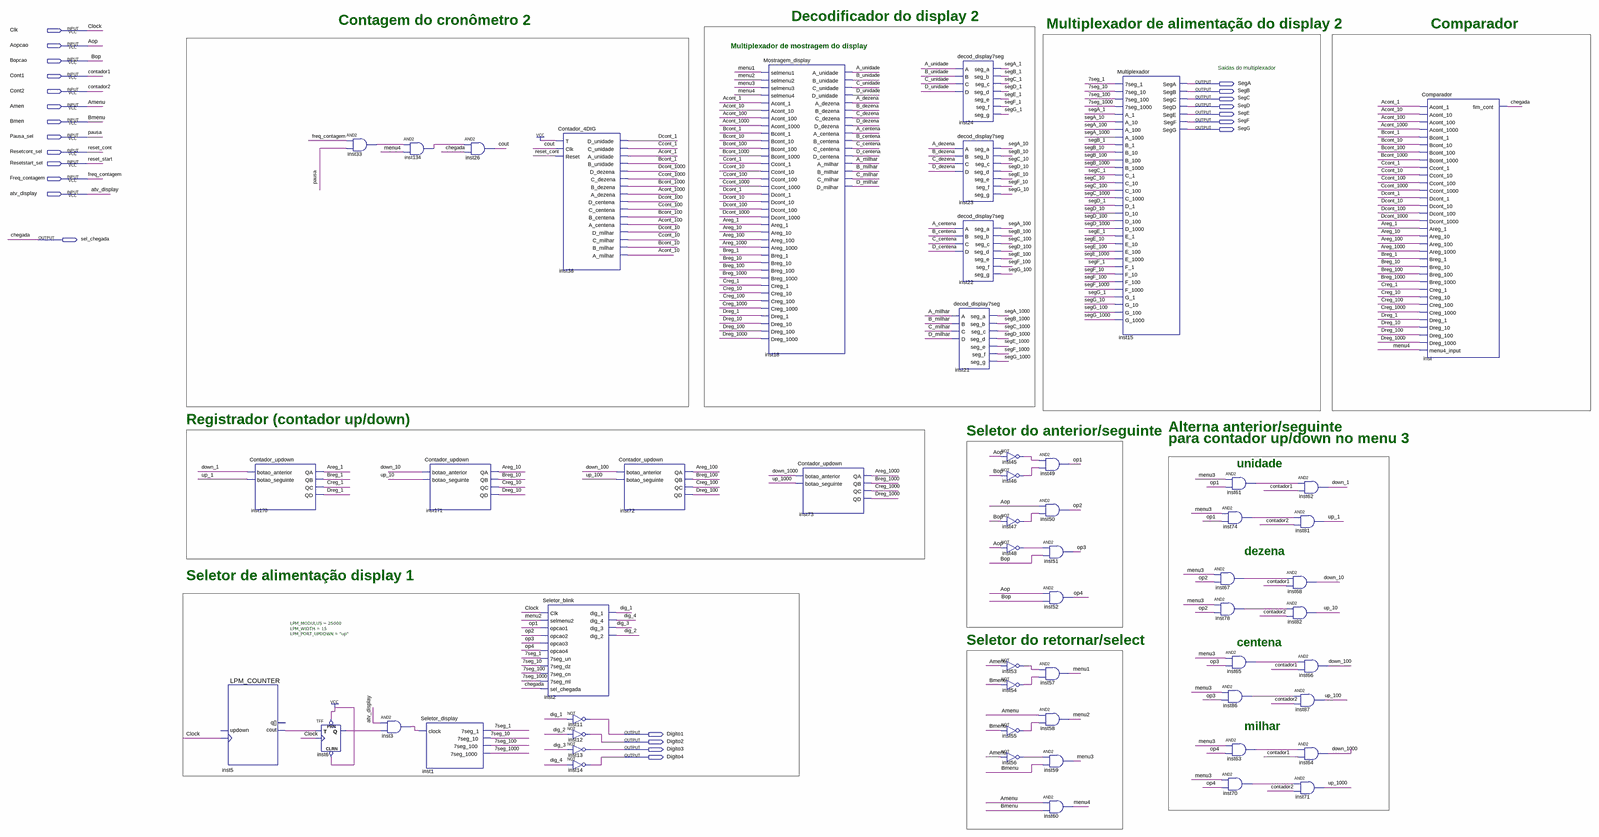
[diagram p0: schematic sheet, whole]
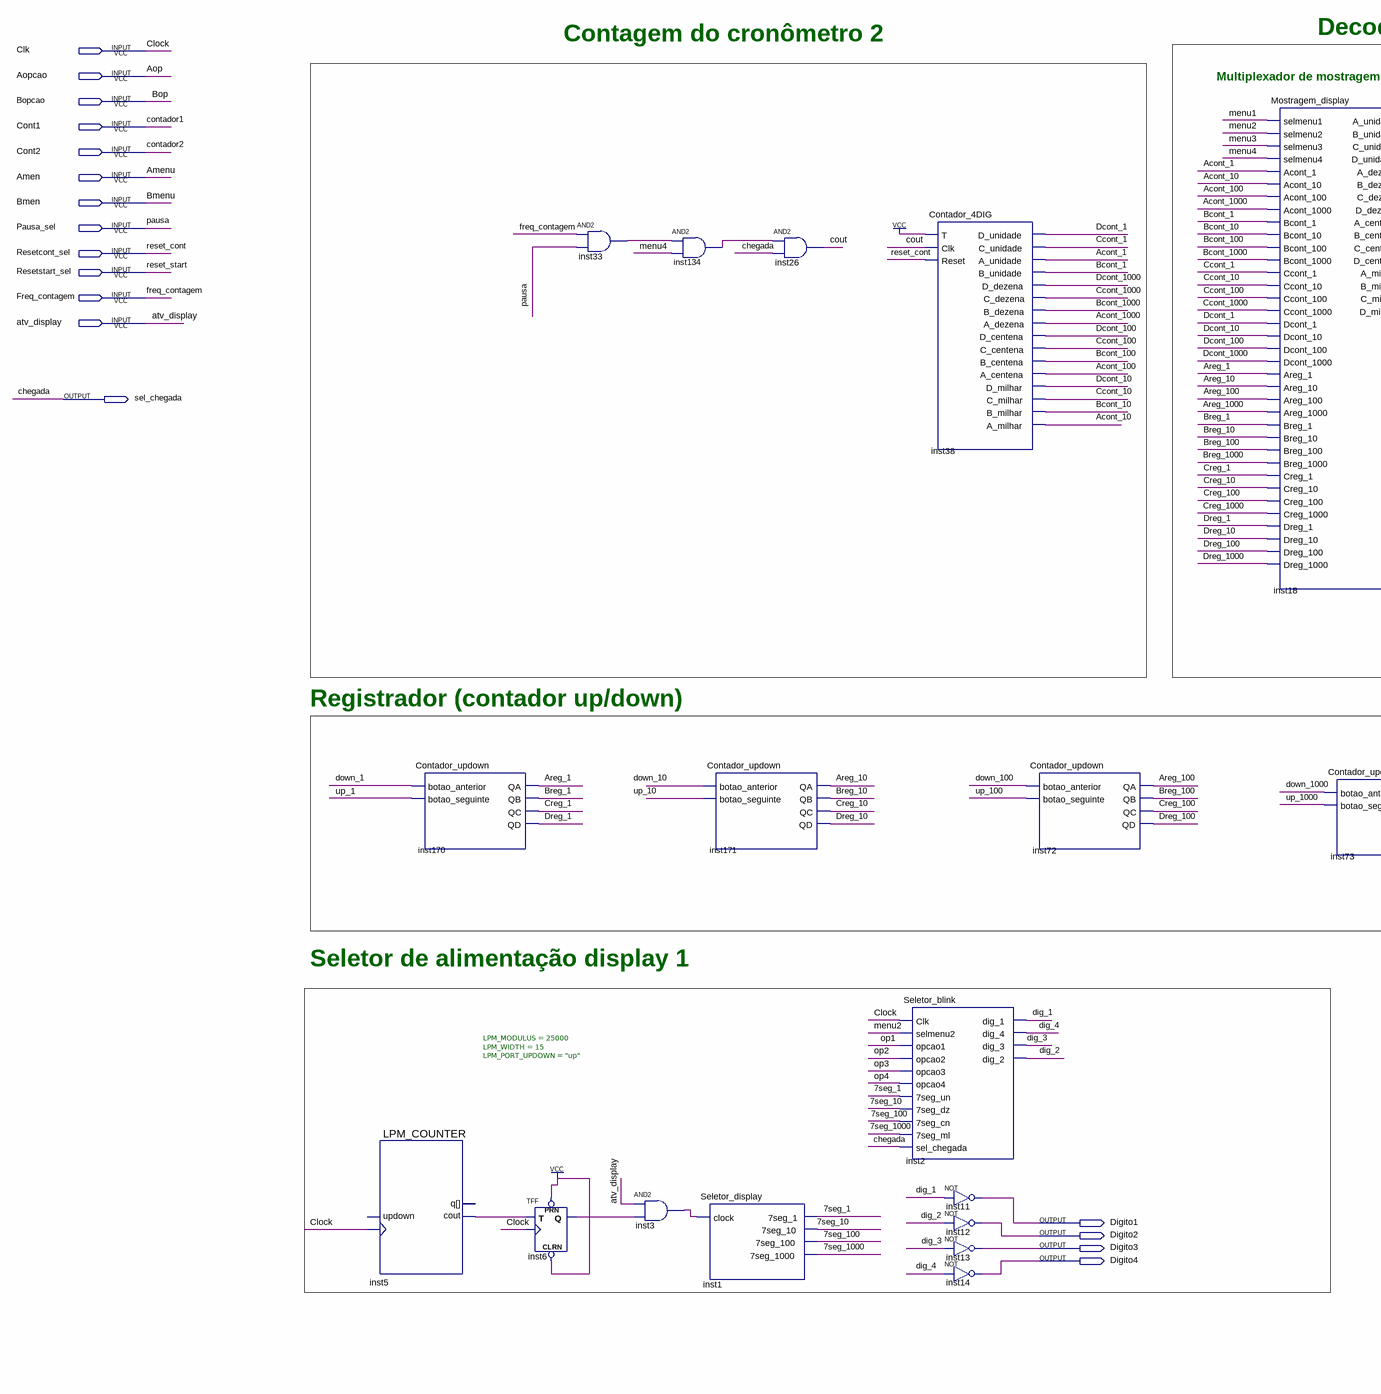
[diagram p1: schematic sheet, left part]
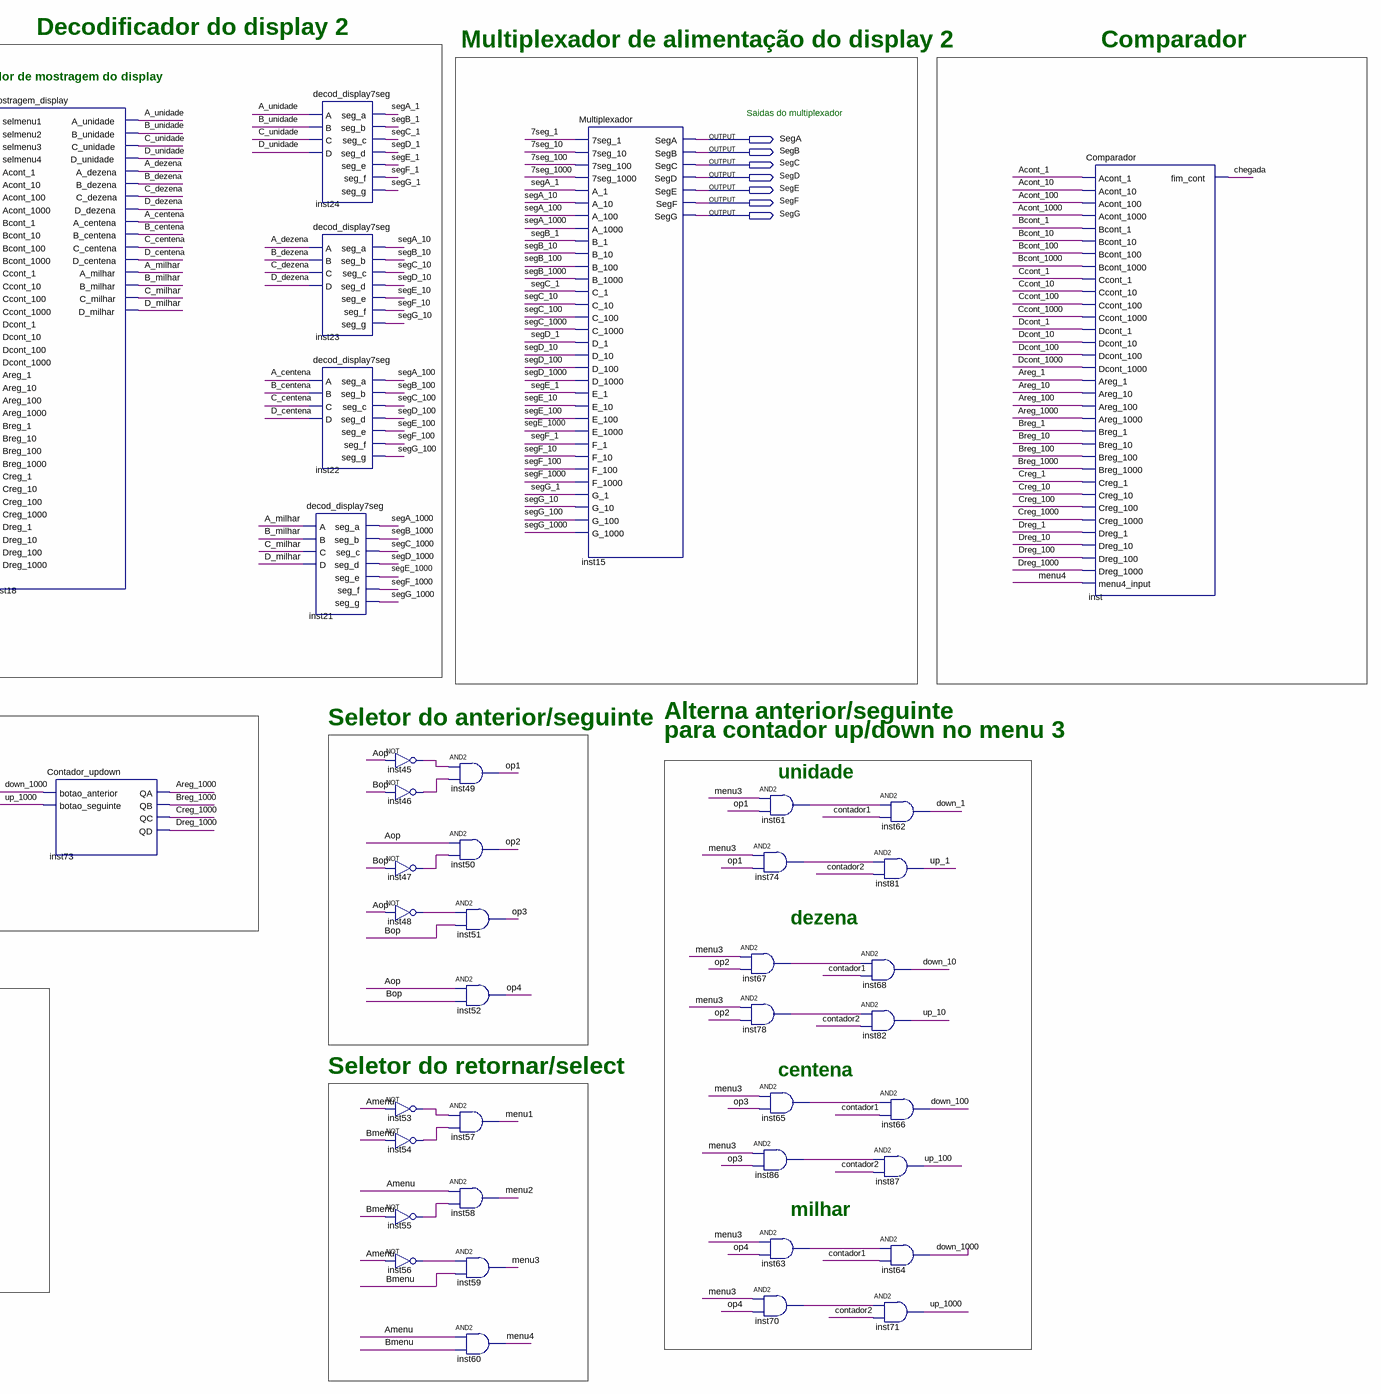
[diagram p2: schematic sheet, right part]
// Quartus schematic Cronometro_2.bdf as structural Verilog: 56 symbols, 24 pins
module Cronometro_2 (
  input  Clk,
  input  Aopcao,
  input  Bopcao,
  input  Cont1,
  input  Cont2,
  input  Amen,
  input  Bmen,
  input  Pausa_sel,
  input  Resetcont_sel,
  input  Resetstart_sel,
  input  Freq_contagem,
  input  atv_display,
  output SegA,
  output SegB,
  output SegC,
  output SegD,
  output SegE,
  output SegF,
  output SegG,
  output sel_chegada,
  output Digito1,
  output Digito2,
  output Digito3,
  output Digito4
);

  wire \7seg_1 , \7seg_10 , \7seg_100 , \7seg_1000 , A_centena, A_dezena, A_milhar, A_unidade, Acont_1,
       Acont_10, Acont_100, Acont_1000, Areg_1, Areg_10, Areg_100, Areg_1000, B_centena, B_dezena, B_milhar,
       B_unidade, Bcont_1, Bcont_10, Bcont_100, Bcont_1000, Breg_1, Breg_10, Breg_100, Breg_1000, C_centena,
       C_dezena, C_milhar, C_unidade, Ccont_1, Ccont_10, Ccont_100, Ccont_1000, cout, Creg_1, Creg_10,
       Creg_100, Creg_1000, D_centena, D_dezena, D_milhar, D_unidade, Dcont_1, Dcont_10, Dcont_100,
       Dcont_1000, dig_1, dig_2, dig_3, dig_4, down_1, down_10, down_100, down_1000, Dreg_1, Dreg_10,
       Dreg_100, Dreg_1000, inst3_out, inst5_cout, inst6_q, inst33_out, inst45_out, inst46_out, inst47_out,
       inst48_out, inst53_out, inst54_out, inst55_out, inst56_out, inst61_out, inst63_out, inst65_out,
       inst67_out, inst70_out, inst74_out, inst78_out, inst86_out, inst134_out, menu1, menu2, menu3, menu4,
       op1, op2, op3, op4, segA_1, segA_10, segA_100, segA_1000, segB_1, segB_10, segB_100, segB_1000,
       segC_1, segC_10, segC_100, segC_1000, segD_1, segD_10, segD_100, segD_1000, segE_1, segE_10, segE_100,
       segE_1000, segF_1, segF_10, segF_100, segF_1000, segG_1, segG_10, segG_100, segG_1000, up_1, up_10,
       up_100, up_1000;

  LPM_COUNTER #(.LPM_MODULUS(25000), .LPM_WIDTH(15), .LPM_PORT_UPDOWN("up")) inst5 (
    .clock(Clk), .cout(inst5_cout));  // open: updown, q
  Contador_updown inst170 (
    .botao_anterior(down_1), .botao_seguinte(up_1), .QA(Areg_1), .QB(Breg_1), .QC(Creg_1), .QD(Dreg_1));
  TFF inst6 (.PRN(1'b1), .CLRN(1'b1), .T(inst5_cout), .CLK(Clk), .Q(inst6_q));
  and inst33 (inst33_out, Freq_contagem, Pausa_sel);
  and inst134 (inst134_out, inst33_out, menu4);
  and inst3 (inst3_out, atv_display, inst6_q);
  Contador_updown inst171 (
    .botao_anterior(down_10), .botao_seguinte(up_10), .QA(Areg_10), .QB(Breg_10), .QC(Creg_10), .QD(Dreg_10));
  Seletor_display inst1 (
    .clock(inst3_out), .\7seg_1 (\7seg_1 ), .\7seg_10 (\7seg_10 ), .\7seg_100 (\7seg_100 ),
    .\7seg_1000 (\7seg_1000 ));
  and inst26 (cout, inst134_out, sel_chegada);
  Contador_4DIG inst38 (
    .T(1'b1), .Clk(cout), .Reset(Resetcont_sel), .D_unidade(Dcont_1), .C_unidade(Ccont_1),
    .A_unidade(Acont_1), .B_unidade(Bcont_1), .D_dezena(Dcont_1000), .C_dezena(Ccont_1000),
    .B_dezena(Bcont_1000), .A_dezena(Acont_1000), .D_centena(Dcont_100), .C_centena(Ccont_100),
    .B_centena(Bcont_100), .A_centena(Acont_100), .D_milhar(Dcont_10), .C_milhar(Ccont_10),
    .B_milhar(Bcont_10), .A_milhar(Acont_10));
  Seletor_blink inst2 (
    .Clk(Clk), .selmenu2(menu2), .opcao1(op1), .opcao2(op2), .opcao3(op3), .opcao4(op4),
    .\7seg_un (\7seg_1 ), .\7seg_dz (\7seg_10 ), .\7seg_cn (\7seg_100 ), .\7seg_ml (\7seg_1000 ),
    .sel_chegada(sel_chegada), .dig_1(dig_1), .dig_4(dig_4), .dig_3(dig_3), .dig_2(dig_2));
  not inst11 (Digito1, dig_1);
  not inst12 (Digito2, dig_2);
  not inst13 (Digito3, dig_3);
  not inst14 (Digito4, dig_4);
  Contador_updown inst72 (
    .botao_anterior(down_100), .botao_seguinte(up_100), .QA(Areg_100), .QB(Breg_100), .QC(Creg_100),
    .QD(Dreg_100));
  Mostragem_display inst18 (
    .selmenu1(menu1), .selmenu2(menu2), .selmenu3(menu3), .selmenu4(menu4), .Acont_1(Acont_1),
    .Acont_10(Acont_10), .Acont_100(Acont_100), .Acont_1000(Acont_1000), .Bcont_1(Bcont_1),
    .Bcont_10(Bcont_10), .Bcont_100(Bcont_100), .Bcont_1000(Bcont_1000), .Ccont_1(Ccont_1),
    .Ccont_10(Ccont_10), .Ccont_100(Ccont_100), .Ccont_1000(Ccont_1000), .Dcont_1(Dcont_1),
    .Dcont_10(Dcont_10), .Dcont_100(Dcont_100), .Dcont_1000(Dcont_1000), .Areg_1(Areg_1), .Areg_10(Areg_10),
    .Areg_100(Areg_100), .Areg_1000(Areg_1000), .Breg_1(Breg_1), .Breg_10(Breg_10), .Breg_100(Breg_100),
    .Breg_1000(Breg_1000), .Creg_1(Creg_1), .Creg_10(Creg_10), .Creg_100(Creg_100), .Creg_1000(Creg_1000),
    .Dreg_1(Dreg_1), .Dreg_10(Dreg_10), .Dreg_100(Dreg_100), .Dreg_1000(Dreg_1000), .A_unidade(A_unidade),
    .B_unidade(B_unidade), .C_unidade(C_unidade), .D_unidade(D_unidade), .A_dezena(A_dezena),
    .B_dezena(B_dezena), .C_dezena(C_dezena), .D_dezena(D_dezena), .A_centena(A_centena),
    .B_centena(B_centena), .C_centena(C_centena), .D_centena(D_centena), .A_milhar(A_milhar),
    .B_milhar(B_milhar), .C_milhar(C_milhar), .D_milhar(D_milhar));
  Contador_updown inst73 (
    .botao_anterior(down_1000), .botao_seguinte(up_1000), .QA(Areg_1000), .QB(Breg_1000), .QC(Creg_1000),
    .QD(Dreg_1000));
  decod_display7seg inst24 (
    .A(A_unidade), .B(B_unidade), .C(C_unidade), .D(D_unidade), .seg_a(segA_1), .seg_b(segB_1),
    .seg_c(segC_1), .seg_d(segD_1), .seg_e(segE_1), .seg_f(segF_1), .seg_g(segG_1));
  decod_display7seg inst23 (
    .A(A_dezena), .B(B_dezena), .C(C_dezena), .D(D_dezena), .seg_a(segA_10), .seg_b(segB_10),
    .seg_c(segC_10), .seg_d(segD_10), .seg_e(segE_10), .seg_f(segF_10), .seg_g(segG_10));
  decod_display7seg inst22 (
    .A(A_centena), .B(B_centena), .C(C_centena), .D(D_centena), .seg_a(segA_100), .seg_b(segB_100),
    .seg_c(segC_100), .seg_d(segD_100), .seg_e(segE_100), .seg_f(segF_100), .seg_g(segG_100));
  decod_display7seg inst21 (
    .A(A_milhar), .B(B_milhar), .C(C_milhar), .D(D_milhar), .seg_a(segA_1000), .seg_b(segB_1000),
    .seg_c(segC_1000), .seg_d(segD_1000), .seg_e(segE_1000), .seg_f(segF_1000), .seg_g(segG_1000));
  not inst45 (inst45_out, Aopcao);
  not inst46 (inst46_out, Bopcao);
  not inst47 (inst47_out, Bopcao);
  not inst48 (inst48_out, Aopcao);
  not inst53 (inst53_out, Amen);
  not inst54 (inst54_out, Bmen);
  not inst55 (inst55_out, Bmen);
  not inst56 (inst56_out, Amen);
  and inst49 (op1, inst45_out, inst46_out);
  and inst50 (op2, Aopcao, inst47_out);
  and inst51 (op3, inst48_out, Bopcao);
  and inst52 (op4, Aopcao, Bopcao);
  and inst57 (menu1, inst53_out, inst54_out);
  and inst58 (menu2, Amen, inst55_out);
  and inst59 (menu3, inst56_out, Bmen);
  and inst60 (menu4, Amen, Bmen);
  Multiplexador inst15 (
    .\7seg_1 (\7seg_1 ), .\7seg_10 (\7seg_10 ), .\7seg_100 (\7seg_100 ), .\7seg_1000 (\7seg_1000 ),
    .A_1(segA_1), .A_10(segA_10), .A_100(segA_100), .A_1000(segA_1000), .B_1(segB_1), .B_10(segB_10),
    .B_100(segB_100), .B_1000(segB_1000), .C_1(segC_1), .C_10(segC_10), .C_100(segC_100), .C_1000(segC_1000),
    .D_1(segD_1), .D_10(segD_10), .D_100(segD_100), .D_1000(segD_1000), .E_1(segE_1), .E_10(segE_10),
    .E_100(segE_100), .E_1000(segE_1000), .F_1(segF_1), .F_10(segF_10), .F_100(segF_100), .F_1000(segF_1000),
    .G_1(segG_1), .G_10(segG_10), .G_100(segG_100), .G_1000(segG_1000), .SegA(SegA), .SegB(SegB),
    .SegC(SegC), .SegD(SegD), .SegE(SegE), .SegF(SegF), .SegG(SegG));
  and inst61 (inst61_out, menu3, op1);
  and inst74 (inst74_out, menu3, op1);
  and inst67 (inst67_out, menu3, op2);
  and inst78 (inst78_out, menu3, op2);
  and inst65 (inst65_out, menu3, op3);
  and inst86 (inst86_out, menu3, op3);
  and inst63 (inst63_out, menu3, op4);
  and inst70 (inst70_out, menu3, op4);
  and inst68 (down_10, inst67_out, Cont1);
  and inst82 (up_10, inst78_out, Cont2);
  and inst62 (down_1, inst61_out, Cont1);
  and inst81 (up_1, inst74_out, Cont2);
  and inst66 (down_100, inst65_out, Cont1);
  and inst87 (up_100, inst86_out, Cont2);
  and inst64 (down_1000, inst63_out, Cont1);
  and inst71 (up_1000, inst70_out, Cont2);
  Comparador inst (
    .Acont_1(Acont_1), .Acont_10(Acont_10), .Acont_100(Acont_100), .Acont_1000(Acont_1000),
    .Bcont_1(Bcont_1), .Bcont_10(Bcont_10), .Bcont_100(Bcont_100), .Bcont_1000(Bcont_1000),
    .Ccont_1(Ccont_1), .Ccont_10(Ccont_10), .Ccont_100(Ccont_100), .Ccont_1000(Ccont_1000),
    .Dcont_1(Dcont_1), .Dcont_10(Dcont_10), .Dcont_100(Dcont_100), .Dcont_1000(Dcont_1000), .Areg_1(Areg_1),
    .Areg_10(Areg_10), .Areg_100(Areg_100), .Areg_1000(Areg_1000), .Breg_1(Breg_1), .Breg_10(Breg_10),
    .Breg_100(Breg_100), .Breg_1000(Breg_1000), .Creg_1(Creg_1), .Creg_10(Creg_10), .Creg_100(Creg_100),
    .Creg_1000(Creg_1000), .Dreg_1(Dreg_1), .Dreg_10(Dreg_10), .Dreg_100(Dreg_100), .Dreg_1000(Dreg_1000),
    .menu4_input(menu4), .fim_cont(sel_chegada));

  // Other names for the same wires on the sheet: Amenu = Amen; Aop = Aopcao; Bmenu = Bmen; Bop = Bopcao;
  //   chegada = sel_chegada; Clock = Clk; contador1 = Cont1; contador2 = Cont2; pausa = Pausa_sel;
  //   reset_cont = Resetcont_sel; reset_start = Resetstart_sel

  // Notes on the sheet:
  //   Decodificador do display 2
  //   Contagem do cronômetro 2
  //   Multiplexador de alimentação do display 2
  //   Comparador
  //   Multiplexador de mostragem do display
  //   Saidas do multiplexador
  //   Registrador (contador up/down)
  //   Alterna anterior/seguinte
  //   Seletor do anterior/seguinte
  //   para contador up/down no menu 3
  //   unidade
  //   dezena
  //   Seletor de alimentação display 1
  //   Seletor do retornar/select
  //   centena
  //   milhar
endmodule
